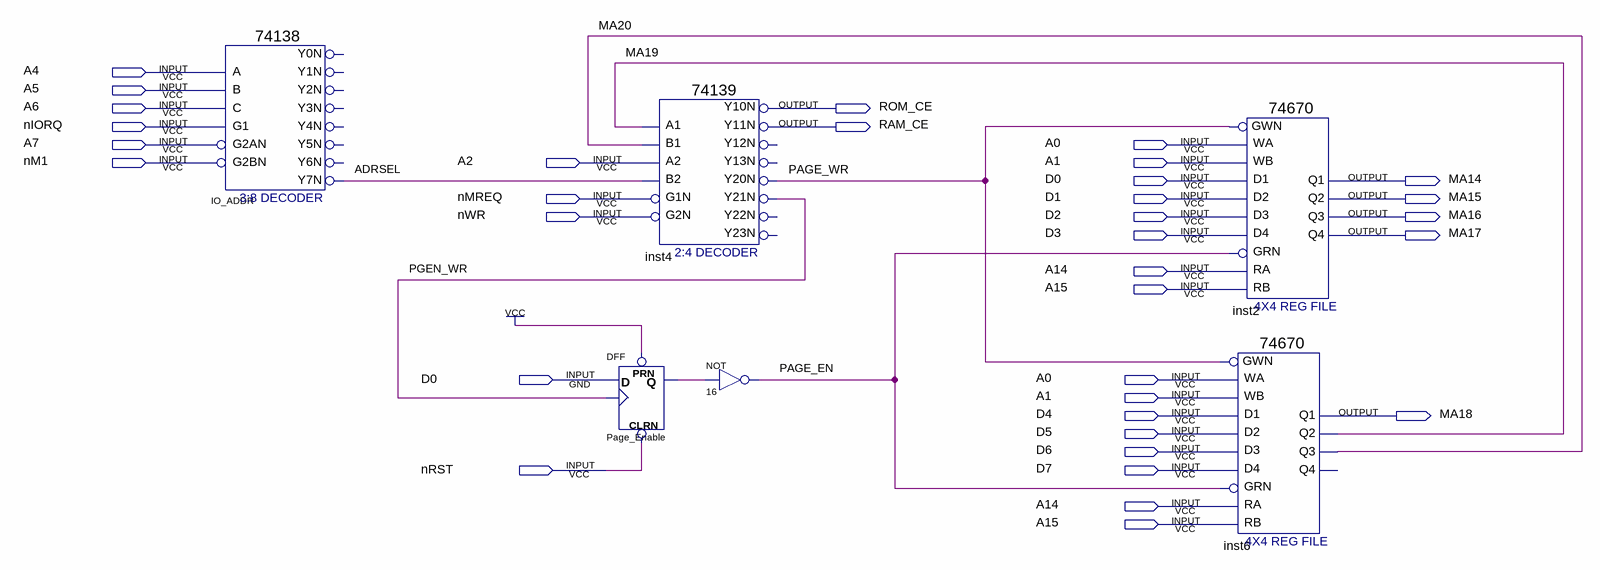
[diagram p0: schematic sheet]
// Quartus schematic Block1.bdf as structural Verilog: 6 symbols, 34 pins
module Block1 (
  input  A4,
  input  A5,
  input  A6,
  input  nIORQ,
  input  A7,
  input  A0,
  input  nM1,
  input  A2,
  input  A1,
  input  D0,
  input  nMREQ,
  input  D1,
  input  nWR,
  input  D2,
  input  D3,
  input  A14,
  input  A15,
  input  D4,
  input  D5,
  input  D6,
  input  nRST,
  input  D7,
  output ROM_CE,
  output RAM_CE,
  output MA14,
  output MA15,
  output MA16,
  output MA17,
  output MA18
);

  wire ADRSEL, MA19, MA20, PAGE_EN, Page_Enable_q, PAGE_WR, PGEN_WR;

  \74138  IO_ADDR (
    .A(A4), .B(A5), .G1(nIORQ), .C(A6), .G2AN(A7), .G2BN(nM1), .Y7N(ADRSEL));  // open: Y0N, Y1N, Y2N, Y3N, Y4N, Y5N, Y6N
  DFF Page_Enable (.CLRN(nRST), .CLK(PGEN_WR), .D(D0), .PRN(1'b1), .Q(Page_Enable_q));
  \74139  inst4 (
    .A1(MA19), .A2(A2), .B1(MA20), .B2(ADRSEL), .G1N(nMREQ), .G2N(nWR), .Y10N(ROM_CE), .Y20N(PAGE_WR),
    .Y11N(RAM_CE), .Y21N(PGEN_WR));  // open: Y13N, Y12N, Y22N, Y23N
  not u_16 (PAGE_EN, Page_Enable_q);
  \74670  inst2 (
    .WA(A0), .D1(D0), .WB(A1), .D2(D1), .GRN(PAGE_EN), .D4(D3), .D3(D2), .RA(A14), .RB(A15), .GWN(PAGE_WR),
    .Q3(MA16), .Q4(MA17), .Q1(MA14), .Q2(MA15));
  \74670  inst6 (
    .WA(A0), .D1(D4), .WB(A1), .D2(D5), .GRN(PAGE_EN), .D4(D7), .D3(D6), .RA(A14), .RB(A15), .GWN(PAGE_WR),
    .Q3(MA20), .Q1(MA18), .Q2(MA19));  // open: Q4
endmodule
